# EAGLE design daclock-1.2 (EAGLE 7.3.0)
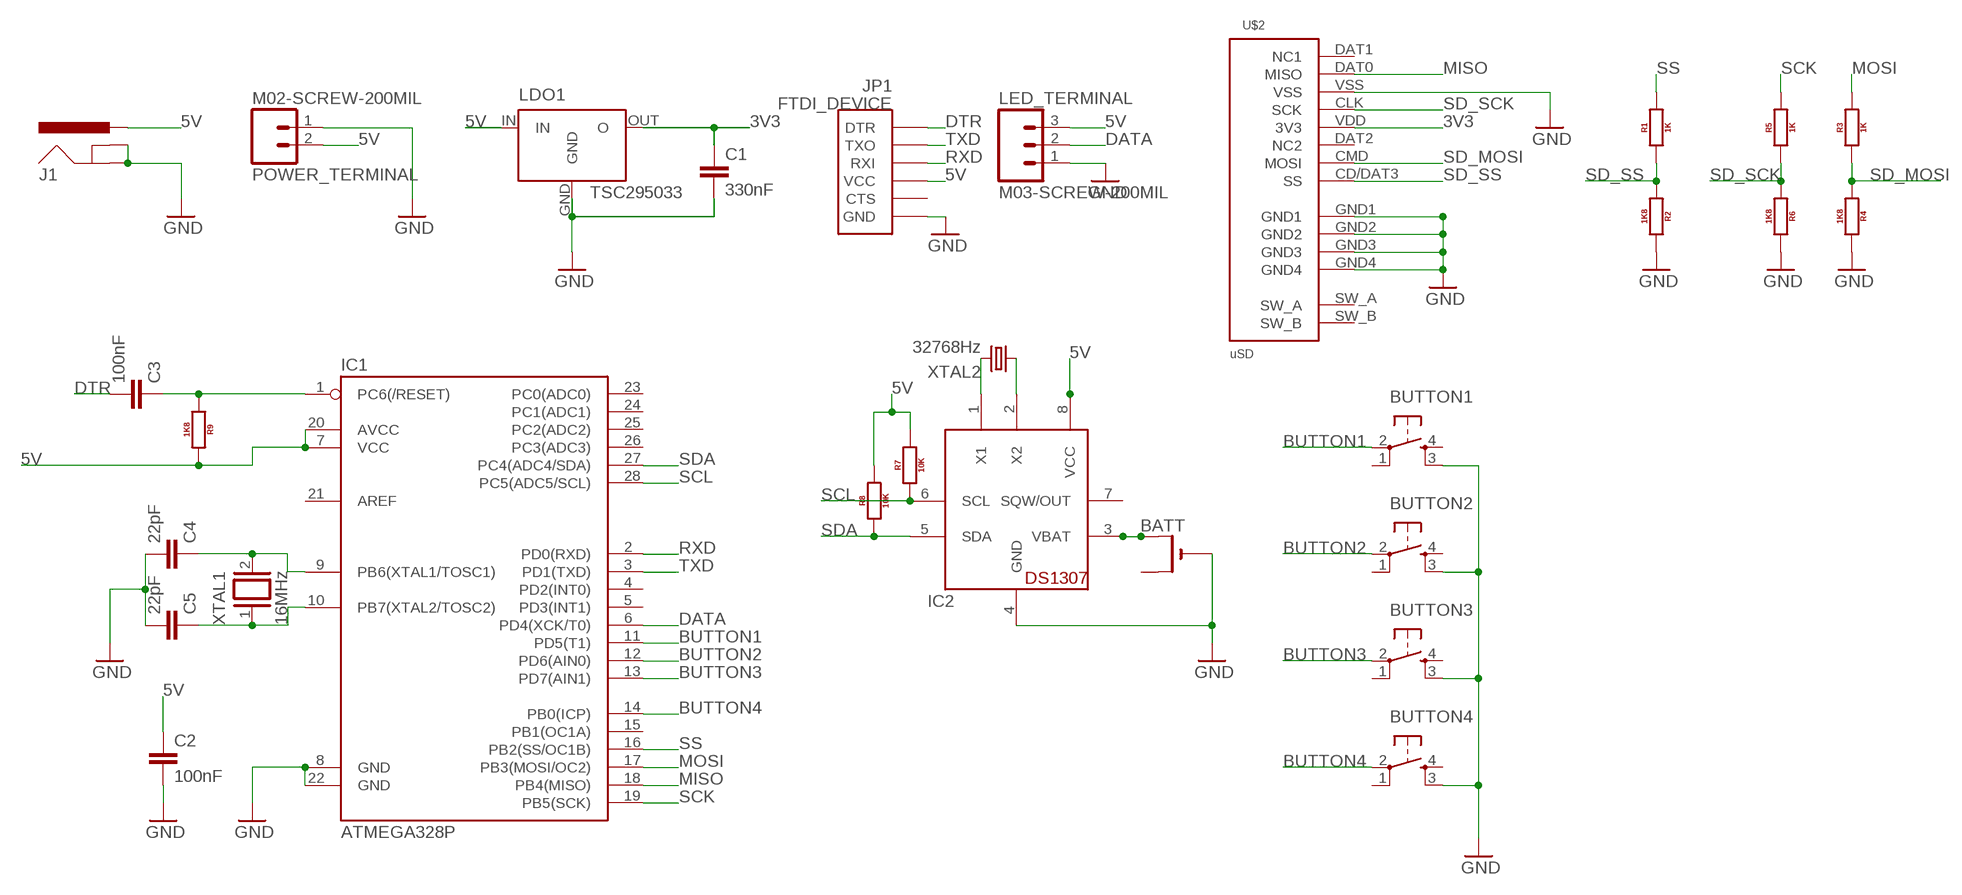
[diagram p0: schematic, sheet 1]

## Parts
BATT  CR2032SMT  [CR2032-SMD]
BUTTON1  B1  TACTILE_BUTTON  [TACTILE_BUTTON]
BUTTON2  B2  TACTILE_BUTTON  [TACTILE_BUTTON]
BUTTON3  B3  TACTILE_BUTTON  [TACTILE_BUTTON]
BUTTON4  B4  TACTILE_BUTTON  [TACTILE_BUTTON]
C1  330nF  C-EU050-025X075  [C050-025X075]
C2  100nF  C-EU050-025X075  [C050-025X075]
C3  100nF  C-EU050-025X075  [C050-025X075]
C4  22pF  C-EU050-025X075  [C050-025X075]
C5  22pF  C-EU050-025X075  [C050-025X075]
IC1  ATMEGA328P  ATMEGA328P_PDIP  [DIL28-3]
IC2  DS1307  [DIL08]
J1  POWER_JACKPTH  [POWER_JACK_PTH]
JP1  FTDI_DEVICE  [FTDI_DEVICE_SIDE]
LDO1  TSC295033  LP2950Z  [TO92]
LED_TERMINAL  M03-SCREW-200MIL  [SCREWTERMINAL-200MIL-3]
POWER_TERMINAL  M02-SCREW-200MIL  [SCREWTERMINAL-200MIL-2]
R1  1K  RESISTOR-400MIL  [AXIAL-0.4]
R2  1K8  RESISTOR-400MIL  [AXIAL-0.4]
R3  1K  RESISTOR-400MIL  [AXIAL-0.4]
R4  1K8  RESISTOR-400MIL  [AXIAL-0.4]
R5  1K  RESISTOR-400MIL  [AXIAL-0.4]
R6  1K8  RESISTOR-400MIL  [AXIAL-0.4]
R7  10K  RESISTOR-400MIL  [AXIAL-0.4]
R8  10K  RESISTOR-400MIL  [AXIAL-0.4]
R9  1K8  RESISTOR-400MIL  [AXIAL-0.4]
U$2  uSD  MICROSD-HRS_DM3D  [DM3D]
XTAL1  16MHz  XTAL/S  [QS]
XTAL2  32768Hz  CRYSTAL_TC38H  [TC38H]

## Nets
3V3: C1.1 LDO1.OUT(O) U$2.VDD(3V3)
5V: C2.1 IC1.7(VCC) IC1.20(AVCC) IC2.8(VCC) J1.PWR JP1.P$4(VCC) LDO1.IN LED_TERMINAL.3 POWER_TERMINAL.2 R7.P$2 R8.P$2 R9.P$2
BUTTON1: BUTTON1.2(SWA1) IC1.11(PD5(T1))
BUTTON2: BUTTON2.2(SWA1) IC1.12(PD6(AIN0))
BUTTON3: BUTTON3.2(SWA1) IC1.13(PD7(AIN1))
BUTTON4: BUTTON4.2(SWA1) IC1.14(PB0(ICP))
DATA: IC1.6(PD4(XCK/T0)) LED_TERMINAL.2
DTR: C3.2 JP1.P$1(DTR)
GND: BATT.- BUTTON1.3(SWB2) BUTTON2.3(SWB2) BUTTON3.3(SWB2) BUTTON4.3(SWB2) C1.2 C2.2 C4.2 C5.2 IC1.8(GND) IC1.22(GND) IC2.4(GND) J1.GND J1.GNDBREAK JP1.P$6(GND) LDO1.GND LED_TERMINAL.1 POWER_TERMINAL.1 R2.P$2 R4.P$2 R6.P$2 U$2.GND1 U$2.GND2 U$2.GND3 U$2.GND4 U$2.VSS
MISO: IC1.18(PB4(MISO)) U$2.DAT0(MISO)
MOSI: IC1.17(PB3(MOSI/OC2)) R3.P$2
N$1: C3.1 IC1.1(PC6(/RESET)) R9.P$1
N$2: C4.1 IC1.9(PB6(XTAL1/TOSC1)) XTAL1.2
N$3: C5.1 IC1.10(PB7(XTAL2/TOSC2)) XTAL1.1
N$4: BATT.+$1(+) IC2.3(VBAT)
N$5: IC2.1(X1) XTAL2.2
N$6: IC2.2(X2) XTAL2.1
RXD: IC1.2(PD0(RXD)) JP1.P$3(RXI)
SCK: IC1.19(PB5(SCK)) R5.P$2
SCL: IC1.28(PC5(ADC5/SCL)) IC2.6(SCL) R7.P$1
SD_MOSI: R3.P$1 R4.P$1 U$2.CMD(MOSI)
SD_SCK: R5.P$1 R6.P$1 U$2.CLK(SCK)
SD_SS: R1.P$1 R2.P$1 U$2.CD/DAT3(SS)
SDA: IC1.27(PC4(ADC4/SDA)) IC2.5(SDA) R8.P$1
SS: IC1.16(PB2(SS/OC1B)) R1.P$2
TXD: IC1.3(PD1(TXD)) JP1.P$2(TXO)
Unconnected: BATT.+$2(+1) BUTTON1.1(SWB1) BUTTON1.4(SWA2) BUTTON2.1(SWB1) BUTTON2.4(SWA2) BUTTON3.1(SWB1) BUTTON3.4(SWA2) BUTTON4.1(SWB1) BUTTON4.4(SWA2) IC1.4(PD2(INT0)) IC1.5(PD3(INT1)) IC1.15(PB1(OC1A)) IC1.21(AREF) IC1.23(PC0(ADC0)) IC1.24(PC1(ADC1)) IC1.25(PC2(ADC2)) IC1.26(PC3(ADC3)) IC2.7(SQW/OUT) JP1.P$5(CTS) U$2.DAT1(NC1) U$2.DAT2(NC2) U$2.SW_A U$2.SW_B

## Library data of the parts
BATT = xose:CR2032
BUTTON1-BUTTON4 = xose:TACTILE_BUTTON: Tactile Button SparkFun Electronics' Tactile Button COM-10302
C1-C5 = xose:C-EU: CAPACITOR, European symbol
IC1 = xose:ATMEGA328P_PDIP: uC used in the Arduino 32kb flash, 1k EEPROM, 2k SRAM This is the through-hole version of this chip.
IC2 = xose:DS1307: DS1307 Real time clock (RTC) with battery backup ability. Talk to it via i2c
J1 = xose:POWER_JACK: Power Jack This is the standard 5.5mm barrel jack for power. The PTH is the most common, proven, reliable, footprint. The Slot footprint only works if the mill layer is transmitted to the PCB fab house so be warned. Mating wall wart : TOL-00298 (and others); PROD_ID: CONN-08197
JP1 = SparkFun-Connectors:FTDI_DEVICE: Connector which mates to FTDI basic or FTDI cable.
LDO1 = xose:LP2950: Adjustable Micropower Voltage Regulator Source: http://www.national.com/ds/LP/LP2950.pdf; MF: NATIONAL SEMICONDUCTOR; MPN: LP2950CZ-5.0/NOPB; OC_FARNELL: 1150320; OC_NEWARK: 41K6545
LED_TERMINAL = xose:M03-SCREW-200MIL
POWER_TERMINAL = xose:M02-SCREW-200MIL
R1-R9 = xose:RESISTOR-400MIL
U$2 = xose:MICROSD-HRS_DM3D
XTAL1 = xose:XTAL/S: CRYSTAL
XTAL2 = xose:CRYSTAL_TC38H

## Board
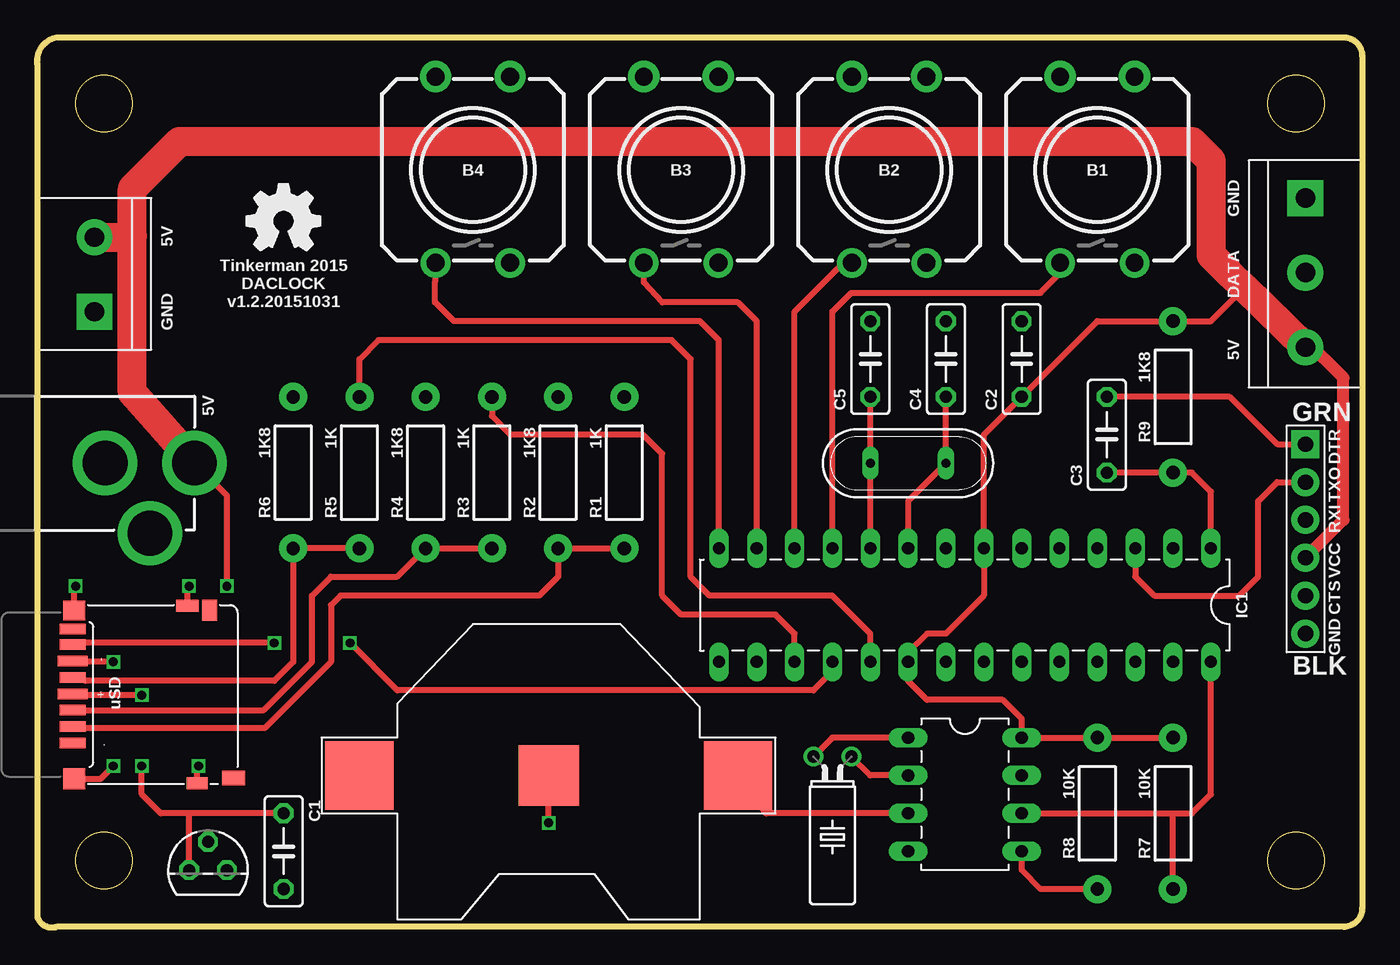
[diagram p1: board, top side]
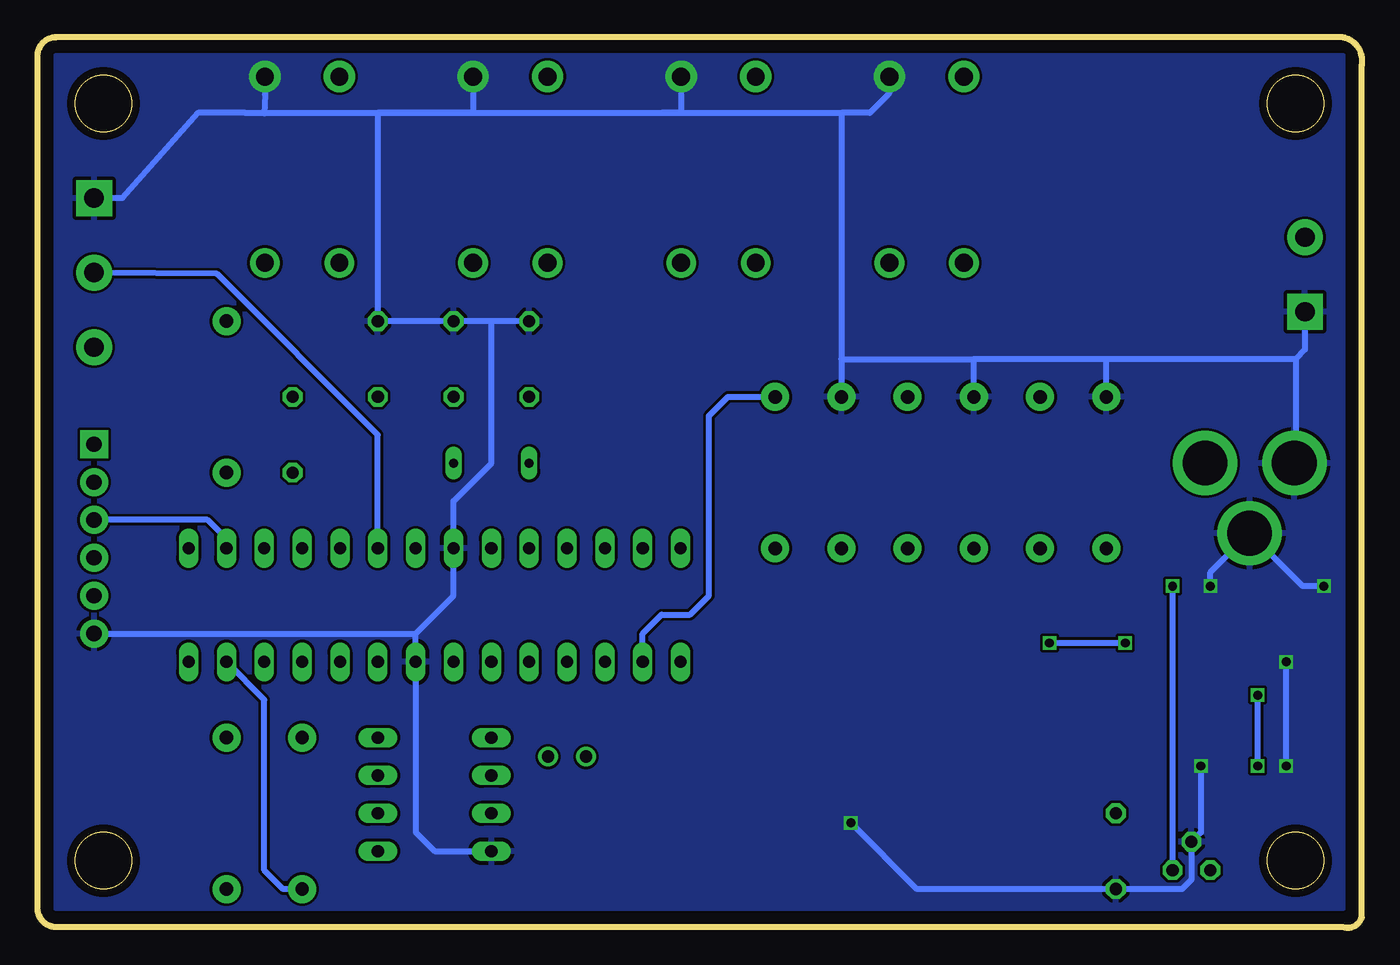
[diagram p2: board, bottom side, seen from below]

Size 88.93 x 59.74 mm. Coordinates in mm from the lower left corner, seen from the top.
Outline: 87.66,0.05 1.3,0.05 arc-90 0.03,0.69 0.03,57.84 arc-90 1.3,59.74 87.66,59.74 arc-90 88.93,58.47 88.93,1.32 arc-90 87.66,0.05
Outline: circle at 4.48,55.3 radius 1.91
Outline: circle at 4.48,4.5 radius 1.91
Outline: circle at 84.49,55.3 radius 1.91
Outline: circle at 84.49,4.5 radius 1.91
Copper layers (1*16): Top 0.035mm / dielectric 1.5mm / Bottom 0.035mm
Design rules "EagleRules": minimum track width 7mil, minimum drill 12mil, track to track 7mil, track to pad 7mil, pad to pad 7mil, via to via 7mil, smd to smd 0mil, copper to edge 20mil, drill to drill 10mil, minimum pad ring 10mil, minimum via ring 6mil, stop-mask expansion 2mil, vias tented up to drill 25mil, thermal gap 10mil

### Footprints (pad centres in the part's own frame; a part is rotated, then mirrored left to right if it is on the bottom)
CR2032-SMD = smd 4.572 x 4.572: +$1 -12.7,0; +$2 12.7,0 | smd 4.064 x 4.064: - 0,0
TACTILE_BUTTON = drill 1.2 pad 2.1: 1 -2.5,6.25; 3 2.5,6.25 | drill 1.2 pad 2: 2 -2.5,-6.25; 4 2.5,-6.25
C050-025X075 = drill 0.813 octagon: 1 -2.54,0; 2 2.54,0
DIL28-3 = drill 0.813 long: 1 -16.51,-3.81; 2 -13.97,-3.81; 3 -11.43,-3.81; 4 -8.89,-3.81; 5 -6.35,-3.81; 6 -3.81,-3.81; 7 -1.27,-3.81; 8 1.27,-3.81; 9 3.81,-3.81; 10 6.35,-3.81; 11 8.89,-3.81; 12 11.43,-3.81; 13 13.97,-3.81; 14 16.51,-3.81; 15 16.51,3.81; 16 13.97,3.81; 17 11.43,3.81; 18 8.89,3.81; 19 6.35,3.81; 20 3.81,3.81; 21 1.27,3.81; 22 -1.27,3.81; 23 -3.81,3.81; 24 -6.35,3.81; 25 -8.89,3.81; 26 -11.43,3.81; 27 -13.97,3.81; 28 -16.51,3.81
DIL08 = drill 0.813 long: 1 -3.81,-3.81; 2 -1.27,-3.81; 3 1.27,-3.81; 4 3.81,-3.81; 5 3.81,3.81; 6 1.27,3.81; 7 -1.27,3.81; 8 -3.81,3.81
POWER_JACK_PTH = drill 2.997 pad 4.318: GND 0,7.7; GNDBREAK 4.7,10.7; PWR 0,13.7
FTDI_DEVICE_SIDE = drill 1.016 pad 1.88 square: P$1 -6.35,0 | drill 1.016 pad 1.88: P$2 -3.81,0; P$3 -1.27,0; P$4 1.27,0; P$5 3.81,0; P$6 6.35,0
TO92 = drill 0.813 octagon: GND 0,1.905; IN 1.27,0; OUT -1.27,0
SCREWTERMINAL-200MIL-3 = drill 1.3 pad 2.413 square: 1 0,0 | drill 1.3 pad 2.413: 2 5,0; 3 10,0
SCREWTERMINAL-200MIL-2 = drill 1.3 pad 2.413 square: 1 0,0 | drill 1.3 pad 2.413: 2 5,0
AXIAL-0.4 = drill 0.9 pad 1.88: P$1 -5.08,0; P$2 5.08,0
DM3D = smd 0.7 x 1.75: CD/DAT3 8.15,0.45; CLK 4.85,0.45; CMD 7.05,0.45; DAT0 2.65,0.45; DAT1 1.6,0.45; DAT2 9.25,0.45 | smd 0.8 x 1.5: GND1 0.05,8.15 | smd 0.8 x 1.4: GND2 11.95,8.8 | smd 1.4 x 1.5: GND3 11.65,0.55 | smd 1.3 x 1.5: GND4 0.35,0.55 | smd 1 x 1.55: SW_A 11.6,11.25 | smd 1.4 x 1: SW_B 0.35,9.65 | smd 0.7 x 2.032: VDD 5.95,0.45; VSS 3.75,0.45
QS = drill 0.61 long: 1 -2.54,0; 2 2.54,0
TC38H = drill 0.813: 1 -1.27,0; 2 1.27,0

### Placement (x,y rotation side)
BATT  34.32,10.21 180 top
BUTTON1  71.15,50.85 0 top
BUTTON2  57.18,50.85 0 top
BUTTON3  43.21,50.85 0 top
BUTTON4  29.24,50.85 0 top
C1  16.54,5.13 270 top
C2  66.07,38.15 90 top
C3  71.79,33.07 90 top
C4  60.99,38.15 90 top
C5  55.91,38.15 90 top
IC1  62.26,21.64 180 top
IC2  62.26,8.94 270 top
J1  -3.14,31.17 270 top
JP1  85.12,26.09 270 top
LDO1  11.46,3.86 0 top
LED_TERMINAL  85.12,48.95 270 top
POWER_TERMINAL  3.84,41.33 90 top
R1  39.4,30.53 90 top
R2  34.96,30.53 90 top
R3  30.51,30.53 90 top
R4  26.07,30.53 90 top
R5  21.62,30.53 90 top
R6  17.18,30.53 90 top
R7  76.23,7.67 90 top
R8  71.15,7.67 90 top
R9  76.23,35.61 90 top
U$2  1.94,21.64 270 top
XTAL1  58.45,31.17 0 top
XTAL2  53.37,11.48 180 top

### Tracks (layer width: path | path; a pad name or v marks a point on that pad's centre or on a via)
3V3  (via drill 0.6)
  Top 0.406: 10.19,7.67 8.29,7.67 7.02,8.94 v7.02,10.85 | v7.02,15.61 2.47,15.61 U$2.VDD | LDO1.OUT 10.19,7.67 | C1.1 10.19,7.67
  Bottom 0.406: v7.02,10.85 v7.02,15.61
5V  (via drill 0.6)
  Top 0.406: R7.P$2 R8.P$2 IC2.8 66.07,14.02 64.8,15.29 59.72,15.29 58.45,16.56 IC1.20 58.45,18.47 59.72,19.74 60.99,19.74 63.53,22.28 IC1.7 63.53,33.07 C2.1 71.15,40.69 R9.P$2 78.77,40.7 81,42.93 | 10.83,30.53 10.56,30.8 J1.PWR 12.73,28.99 v12.73,22.91
  Top 0.813: JP1.P$4 87.66,27.36 87.66,36.88 85.12,39.42 LED_TERMINAL.3
  Top 1.93: J1.PWR 6.38,35.88 6.38,46.41 | 6.38,46.41 6.38,49.58 9.56,52.76 77.5,52.76 78.77,51.49 78.77,45.14 80.04,43.87 81,42.93 LED_TERMINAL.3 | POWER_TERMINAL.2 6.3,46.33 6.38,46.41
  Bottom 0.406: v12.73,22.91 LDO1.IN
BUTTON1
  Top 0.406: BUTTON1.2 68.65,43.91 67.34,42.6 54.64,42.6 53.37,41.33 IC1.11
BUTTON2
  Top 0.406: IC1.12 50.83,41.33 54.01,44.5 54.58,44.5 BUTTON2.2
BUTTON3
  Top 0.406: IC1.13 48.29,40.69 47.02,41.96 41.94,41.96 40.71,43.27 BUTTON3.2
BUTTON4
  Top 0.406: IC1.14 45.75,39.42 44.48,40.69 27.97,40.69 26.7,41.96 26.7,43.33 BUTTON4.2
DATA
  Bottom 0.406: IC1.6 66.07,33.07 76.87,43.87 LED_TERMINAL.2
DTR
  Top 0.406: JP1.P$1 83.22,32.44 80.04,35.61 C3.2
GND  (via drill 0.6)
  Top 0.406: v34.32,7.04 BATT.- | U$2.GND3 4.26,9.99 v5.11,10.85 | v5.11,17.83 2.45,17.83 U$2.VSS | U$2.GND4 2.49,22.83 v2.57,22.91 | U$2.GND1 10.09,22.81 v10.19,22.91 | U$2.GND2 10.74,10.76 v10.83,10.85
  Bottom 0.406: BUTTON1.3 73.65,55.89 73.69,54.62 74.96,54.66 | 74.96,54.66 66.07,54.66 | 47.02,54.66 34.96,54.66 | BUTTON2.3 59.68,54.7 66.07,54.66 | 58.45,40.69 58.45,31.17 60.99,28.63 IC1.8 60.99,22.28 63.53,19.74 | IC2.4 62.26,5.13 63.53,6.4 IC1.22 63.53,19.74 | JP1.P$6 63.53,19.74 | 34.96,38.15 26.07,38.15 | R4.P$2 26.07,38.15 | J1.GND 4.48,31.25 4.48,38.15 | 4.48,38.15 17.18,38.15 | 17.18,38.15 26.07,38.15 | BUTTON3.3 45.71,54.7 47.02,54.66 | 74.96,54.66 78.14,54.66 83.22,48.95 LED_TERMINAL.1 | R6.P$2 17.18,38.15 | 66.07,54.66 47.02,54.66 | 34.96,54.66 34.96,38.15 | 34.96,38.15 R2.P$2 | C5.2 58.45,40.69 | 58.45,40.69 C4.2 C2.2 66.07,54.66 | BUTTON4.3 31.74,55.97 33.05,54.66 34.96,54.66 | v34.32,7.04 29.88,2.59 C1.2 12.1,2.59 11.46,3.23 LDO1.GND 10.83,6.4 v10.83,10.85 | POWER_TERMINAL.1 3.84,38.79 4.48,38.15 | v5.11,10.85 v5.11,17.83 | v2.57,22.91 4,22.91 J1.GNDBREAK 10.19,23.83 v10.19,22.91
  pour Bottom: 1.3,58.47 87.66,58.47 87.66,1.32 1.3,1.32
MISO  (via drill 0.6)
  Top 0.406: IC1.18 53.37,17.2 52.1,15.93 24.16,15.93 v20.99,19.1 | v15.91,19.1 3.13,19.1 U$2.DAT0
  Bottom 0.406: v20.99,19.1 v15.91,19.1
MOSI
  Top 0.406: R3.P$2 30.51,34.34 31.78,33.07 40.67,33.07 41.94,31.8 41.94,22.28 43.21,21.01 49.56,21.01 50.83,19.74 IC1.17
N$1
  Top 0.406: C3.1 R9.P$1 77.5,30.53 78.77,29.26 IC1.1
N$2
  Top 0.406: IC1.9 58.45,28.63 XTAL1.2 C4.1
N$3
  Top 0.406: IC1.10 XTAL1.1 C5.1
N$4
  Top 0.406: IC2.3 48.93,7.67 BATT.+$1
N$5
  Top 0.406: IC2.1 53.37,12.75 XTAL2.2
N$6
  Top 0.406: IC2.2 55.91,10.21 XTAL2.1
RXD
  Bottom 0.406: IC1.2 76.23,26.09 77.5,27.36 JP1.P$3
SCK
  Top 0.406: R5.P$2 21.62,38.15 22.89,39.42 42.58,39.42 43.85,38.15 43.85,23.55 45.12,22.28 53.37,22.28 55.91,19.74 IC1.19
SCL
  Top 0.406: IC2.6 76.23,7.67 | R7.P$1 76.23,7.67 | 76.23,7.67 77.5,7.67 78.77,8.94 IC1.28
SD_MOSI
  Top 0.406: R3.P$1 R4.P$1 24.16,23.55 19.72,23.55 18.45,22.28 18.45,17.83 15.21,14.59 U$2.CMD
SD_SCK
  Top 0.406: R5.P$1 R6.P$1 17.18,17.83 15.91,16.56 3.25,16.56 U$2.CLK
SD_SS
  Top 0.406: R1.P$1 R2.P$1 34.96,23.55 33.69,22.28 20.35,22.28 19.72,21.64 19.72,17.83 15.27,13.39 2.49,13.39 U$2.CD/DAT3
SDA
  Top 0.406: R8.P$1 67.34,2.59 66.07,3.86 IC2.5
  Bottom 0.406: R8.P$1 72.42,2.59 73.69,3.86 73.69,15.29 IC1.27
SS
  Bottom 0.406: R1.P$2 42.58,35.61 43.85,34.34 43.85,22.28 45.12,21.01 47.02,21.01 48.29,19.74 IC1.16
TXD
  Top 0.406: IC1.3 73.69,23.55 74.96,22.28 80.68,22.28 81.95,23.55 81.95,28.63 83.22,29.9 JP1.P$2

### Text on the board
tPlace: GND | 5V | DATA | Tinkerman 2015 / DACLOCK / v1.2.20151031 | GND | 5V | 5V